# EAGLE design Unitbase_Keinz_2022 (EAGLE 9.4.2)

## Sheet 1 of 3
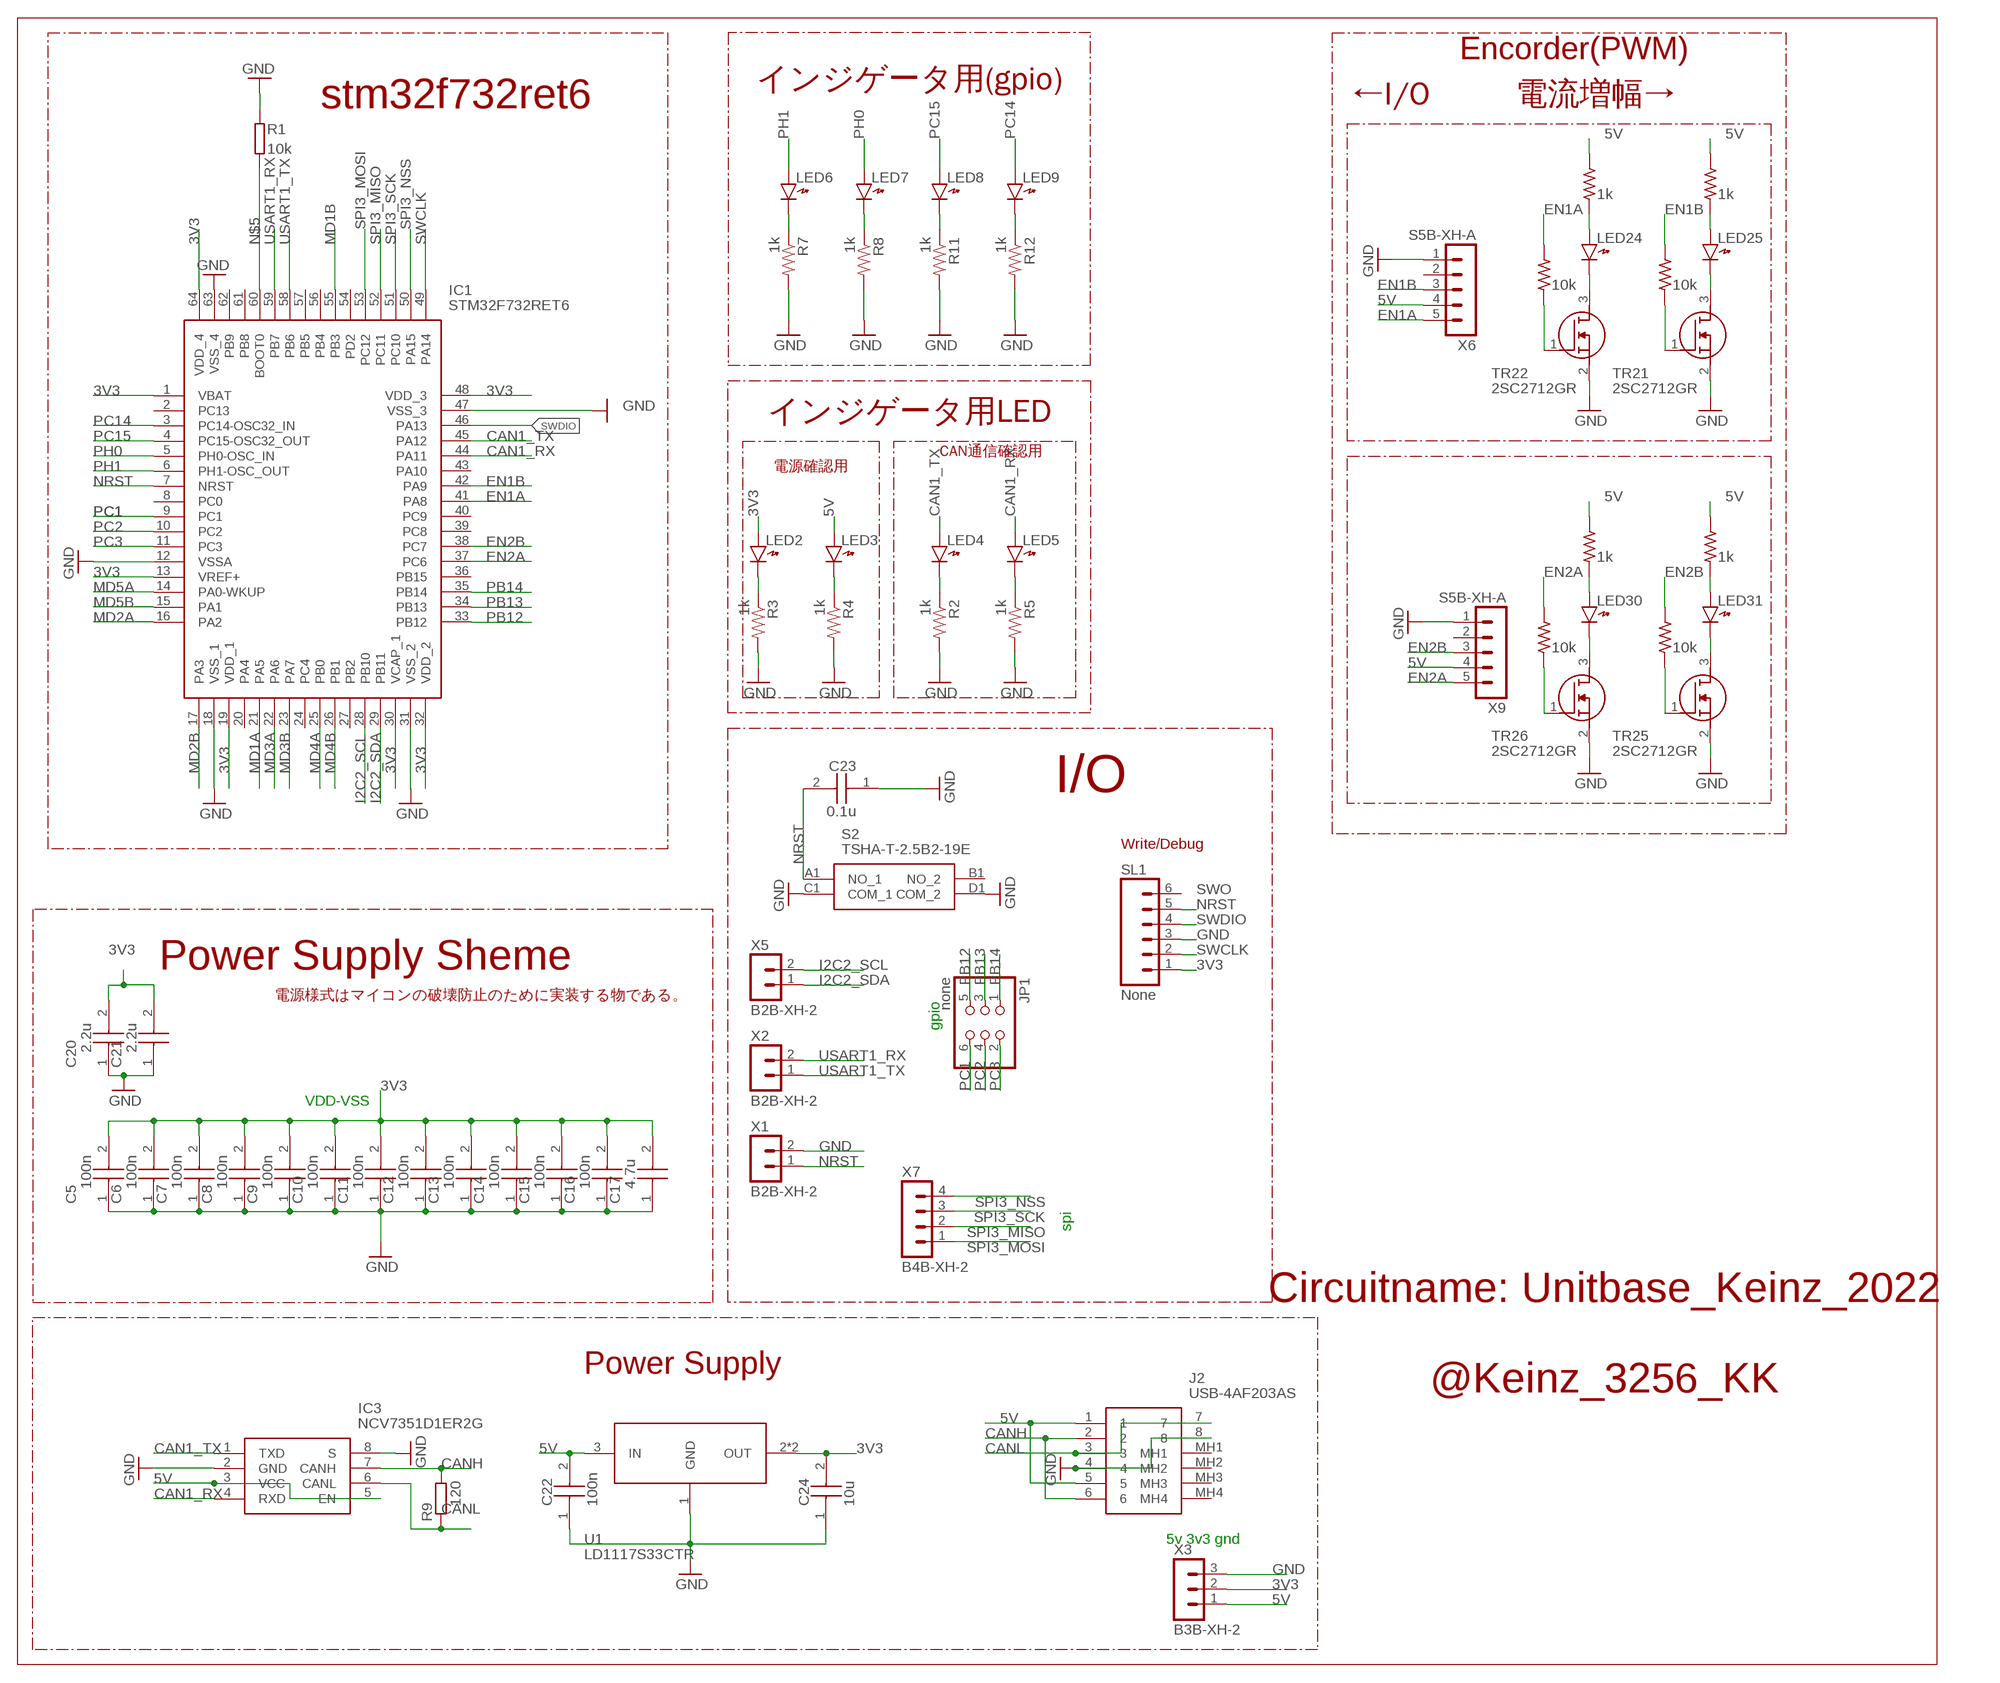
[diagram p0: schematic, sheet 1]

### Parts
C5  100n  AMK107BBJ476MA-RE  [CAPC1709X100N]
C6  100n  AMK107BBJ476MA-RE  [CAPC1709X100N]
C7  100n  AMK107BBJ476MA-RE  [CAPC1709X100N]
C8  100n  AMK107BBJ476MA-RE  [CAPC1709X100N]
C9  100n  AMK107BBJ476MA-RE  [CAPC1709X100N]
C10  100n  AMK107BBJ476MA-RE  [CAPC1709X100N]
C11  100n  AMK107BBJ476MA-RE  [CAPC1709X100N]
C12  100n  AMK107BBJ476MA-RE  [CAPC1709X100N]
C13  100n  AMK107BBJ476MA-RE  [CAPC1709X100N]
C14  100n  AMK107BBJ476MA-RE  [CAPC1709X100N]
C15  100n  AMK107BBJ476MA-RE  [CAPC1709X100N]
C16  100n  AMK107BBJ476MA-RE  [CAPC1709X100N]
C17  4.7u  AMK107BBJ476MA-RE  [CAPC1709X100N]
C20  2.2u  AMK107BBJ476MA-RE  [CAPC1709X100N]
C21  2.2u  AMK107BBJ476MA-RE  [CAPC1709X100N]
C22  100n  GRM188B31A106KE69D  [CAPC1608X90N]
C23  0.1u  AMK107BBJ476MA-RE  [CAPC1709X100N]
C24  10u  GRM188B31A106KE69D  [CAPC1608X90N]
IC1  STM32F732RET6  [QFP50P1200X1200X160-64N@1]
IC3  NCV7351D1ER2G  [SOIC127P600X175-8N]
J2  USB-4AF203AS  [USB4AF203AS]
JP1  none  PINHD-2X3  [2X03]
LED2  LED1608  [LED1608]
LED3  LED1608  [LED1608]
LED4  LED1608  [LED1608]
LED5  LED1608  [LED1608]
LED6  LED1608  [LED1608]
LED7  LED1608  [LED1608]
LED8  LED1608  [LED1608]
LED9  LED1608  [LED1608]
LED24  LED1608  [LED1608]
LED25  LED1608  [LED1608]
LED30  LED1608  [LED1608]
LED31  LED1608  [LED1608]
R1  10k  RESISTOR1608  [SMD1608]
R2  1k  R-US_R0603  [R0603]
R3  1k  R-US_R0603  [R0603]
R4  1k  R-US_R0603  [R0603]
R5  1k  R-US_R0603  [R0603]
R7  1k  R-US_R0603  [R0603]
R8  1k  R-US_R0603  [R0603]
R9  120  R1608  [1608]
R11  1k  R-US_R0603  [R0603]
R12  1k  R-US_R0603  [R0603]
R54  10k  RESISTOR-US1608  [SMD1608]
R59  1k  RESISTOR-US1608  [SMD1608]
R60  10k  RESISTOR-US1608  [SMD1608]
R61  1k  RESISTOR-US1608  [SMD1608]
R66  10k  RESISTOR-US1608  [SMD1608]
R67  1k  RESISTOR-US1608  [SMD1608]
R68  10k  RESISTOR-US1608  [SMD1608]
R69  1k  RESISTOR-US1608  [SMD1608]
S2  TSHA-T-2.5B2-19E  [TSHAT25B219E]
SL1  None  MA06  [06PA]
TR21  2SC2712GR  SOT-23_NMOS  [SOT-23]
TR22  2SC2712GR  SOT-23_NMOS  [SOT-23]
TR25  2SC2712GR  SOT-23_NMOS  [SOT-23]
TR26  2SC2712GR  SOT-23_NMOS  [SOT-23]
U1  LD1117S33CTR  [SOT223]
X1  B2B-XH-2  [B2B-XH-A]
X2  B2B-XH-2  [B2B-XH-A]
X3  B3B-XH-2  [B3B-XH-A]
X5  B2B-XH-2  [B2B-XH-A]
X6  S5B-XH-A  [S5B-XH-A]
X7  B4B-XH-2  [B4B-XH-A]
X9  S5B-XH-A  [S5B-XH-A]

### Nets
3V3: C5.2 C6.2 C7.2 C8.2 C9.2 C10.2 C11.2 C12.2 C13.2 C14.2 C15.2 C16.2 C17.2 C20.2 C21.2 C24.2 IC1.1(VBAT) IC1.13(VREF+) IC1.19(VDD_1) IC1.30(VCAP_1) IC1.32(VDD_2) IC1.48(VDD_3) IC1.64(VDD_4) LED2.A SL1.1 U1.2(OUT) U1.4(OUT) X3.2 ; also sheet 2,3
5V: C22.2 IC3.3(VCC) IC3.5(EN) J2.1 J2.5 LED3.A R59.1 R61.1 R67.1 R69.1 U1.3(IN) X3.1 X6.4 X9.4
CAN1_RX: IC1.44(PA11) IC3.4(RXD) LED5.A
CAN1_TX: IC1.45(PA12) IC3.1(TXD) LED4.A
CANH: IC3.7(CANH) J2.2 J2.6 R9.2
CANL: IC3.6(CANL) J2.3 J2.7 R9.1
EN1A: IC1.41(PA8) R54.1 X6.5
EN1B: IC1.42(PA9) R60.1 X6.3
EN2A: IC1.37(PC6) R66.1 X9.5
EN2B: IC1.38(PC7) R68.1 X9.3
GND: C5.1 C6.1 C7.1 C8.1 C9.1 C10.1 C11.1 C12.1 C13.1 C14.1 C15.1 C16.1 C17.1 C20.1 C21.1 C22.1 C23.1 C24.1 IC1.12(VSSA) IC1.18(VSS_1) IC1.31(VSS_2) IC1.47(VSS_3) IC1.63(VSS_4) IC3.2(GND) IC3.8(S) J2.4 J2.8 R1.1 R2.2 R3.2 R4.2 R5.2 R7.2 R8.2 R11.2 R12.2 S2.C1(COM_1) S2.D1(COM_2) SL1.3 TR21.2(S) TR22.2(S) TR25.2(S) TR26.2(S) U1.1(GND) X1.2 X3.3 X6.1 X9.1 ; also sheet 3
I2C2_SCL: IC1.28(PB10) X5.2
I2C2_SDA: IC1.29(PB11) X5.1
MD1A: IC1.21(PA5) ; also sheet 3
MD1B: IC1.55(PB3) ; also sheet 3
MD2A: IC1.16(PA2) ; also sheet 3
MD2B: IC1.17(PA3) ; also sheet 3
MD3A: IC1.22(PA6) ; also sheet 3
MD3B: IC1.23(PA7) ; also sheet 3
MD4A: IC1.25(PB0) ; also sheet 3
MD4B: IC1.26(PB1) ; also sheet 3
MD5A: IC1.14(PA0-WKUP) ; also sheet 3
MD5B: IC1.15(PA1) ; also sheet 3
N$1: LED7.K R8.1
N$5: IC1.60(BOOT0) R1.2
N$7: LED2.K R3.1
N$8: LED3.K R4.1
N$11: LED5.K R5.1
N$13: LED4.K R2.1
N$20: R54.2 TR22.1(G)
N$21: LED24.K TR22.3(D)
N$22: LED6.K R7.1
N$23: LED9.K R12.1
N$24: LED24.A R59.2
N$25: LED8.K R11.1
N$38: R60.2 TR21.1(G)
N$46: LED25.K TR21.3(D)
N$48: LED25.A R61.2
N$69: R66.2 TR26.1(G)
N$71: LED30.K TR26.3(D)
N$75: LED30.A R67.2
N$77: R68.2 TR25.1(G)
N$81: LED31.K TR25.3(D)
N$83: LED31.A R69.2
NRST: C23.2 IC1.7(NRST) S2.A1(NO_1) SL1.5 X1.1
PB12: IC1.33(PB12) JP1.5
PB13: IC1.34(PB13) JP1.3
PB14: IC1.35(PB14) JP1.1
PC1: IC1.9(PC1) JP1.6
PC2: IC1.10(PC2) JP1.4
PC3: IC1.11(PC3) JP1.2
PC14: IC1.3(PC14-OSC32_IN) LED9.A
PC15: IC1.4(PC15-OSC32_OUT) LED8.A
PH0: IC1.5(PH0-OSC_IN) LED7.A
PH1: IC1.6(PH1-OSC_OUT) LED6.A
SPI3_MISO: IC1.52(PC11) X7.2
SPI3_MOSI: IC1.53(PC12) X7.1
SPI3_NSS: IC1.50(PA15) X7.4
SPI3_SCK: IC1.51(PC10) X7.3
SWCLK: IC1.49(PA14) SL1.2
SWDIO: IC1.46(PA13) SL1.4
USART1_RX: IC1.59(PB7) X2.2
USART1_TX: IC1.58(PB6) X2.1
Unconnected: IC1.2(PC13) IC1.8(PC0) IC1.20(PA4) IC1.24(PC4) IC1.27(PB2) IC1.36(PB15) IC1.39(PC8) IC1.40(PC9) IC1.43(PA10) IC1.54(PD2) IC1.56(PB4) IC1.57(PB5) IC1.61(PB8) IC1.62(PB9) J2.MH1 J2.MH2 J2.MH3 J2.MH4 S2.B1(NO_2) SL1.6 X6.2 X9.2

### Notes on the sheet
- Encorder(PWM)
- インジゲータ用(gpio)
- stm32f732ret6 | ←I/O         電流増幅→
- インジゲータ用LED
- CAN通信確認用
- 電源確認用
- I/O
- Write/Debug
- SWO
- Power Supply Sheme
- 電源様式はマイコンの破壊防止のために実装する物である。
- gpio
- VDD-VSS
- spi
- Circuitname: Unitbase_Keinz_2022
  
  @Keinz_3256_KK
- Power Supply
- 5v 3v3 gnd

## Sheet 2 of 3: 12V
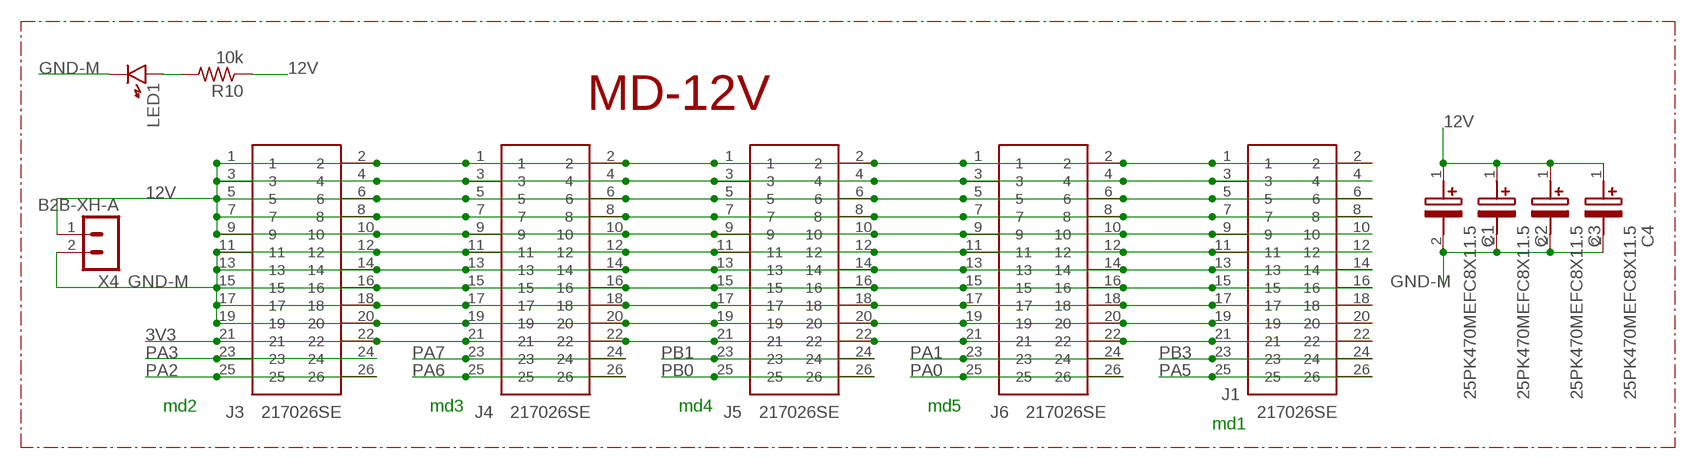
[diagram p1: schematic, sheet 2]

### Parts
C1  25PK470MEFC8X11.5  [CAPPRD350W60D825H1150]
C2  25PK470MEFC8X11.5  [CAPPRD350W60D825H1150]
C3  25PK470MEFC8X11.5  [CAPPRD350W60D825H1150]
C4  25PK470MEFC8X11.5  [CAPPRD350W60D825H1150]
J1  217026SE  [217026SE]
J3  217026SE  [217026SE]
J4  217026SE  [217026SE]
J5  217026SE  [217026SE]
J6  217026SE  [217026SE]
LED1  LED1608  [LED1608]
R10  10k  R-US_R0603  [R0603]
X4  B2B-XH-A  [B2B-XH-A]

### Nets
3V3: J1.21 J1.22 J3.21 J3.22 J4.21 J4.22 J5.21 J5.22 J6.21 J6.22 ; also sheet 1,3
12V: C1.1(+) C2.1(+) C3.1(+) C4.1(+) J1.1 J1.2 J1.3 J1.4 J1.5 J1.6 J1.7 J1.8 J1.9 J1.10 J3.1 J3.2 J3.3 J3.4 J3.5 J3.6 J3.7 J3.8 J3.9 J3.10 J4.1 J4.2 J4.3 J4.4 J4.5 J4.6 J4.7 J4.8 J4.9 J4.10 J5.1 J5.2 J5.3 J5.4 J5.5 J5.6 J5.7 J5.8 J5.9 J5.10 J6.1 J6.2 J6.3 J6.4 J6.5 J6.6 J6.7 J6.8 J6.9 J6.10 R10.1 X4.1
GND-M: C1.2(-) C2.2(-) C3.2(-) C4.2(-) J1.11 J1.12 J1.13 J1.14 J1.15 J1.16 J1.17 J1.18 J1.19 J1.20 J3.11 J3.12 J3.13 J3.14 J3.15 J3.16 J3.17 J3.18 J3.19 J3.20 J4.11 J4.12 J4.13 J4.14 J4.15 J4.16 J4.17 J4.18 J4.19 J4.20 J5.11 J5.12 J5.13 J5.14 J5.15 J5.16 J5.17 J5.18 J5.19 J5.20 J6.11 J6.12 J6.13 J6.14 J6.15 J6.16 J6.17 J6.18 J6.19 J6.20 LED1.K X4.2
N$12: LED1.A R10.2
PA0: J6.25 J6.26 ; also sheet 3
PA1: J6.23 J6.24 ; also sheet 3
PA2: J3.25 J3.26 ; also sheet 3
PA3: J3.23 J3.24 ; also sheet 3
PA5: J1.25 J1.26 ; also sheet 3
PA6: J4.25 J4.26 ; also sheet 3
PA7: J4.23 J4.24 ; also sheet 3
PB0: J5.25 J5.26 ; also sheet 3
PB1: J5.23 J5.24 ; also sheet 3
PB3: J1.23 J1.24 ; also sheet 3

### Notes on the sheet
- MD-12V
- md2 | md3 | md4 | md5
- md1

## Sheet 3 of 3: 電流増幅
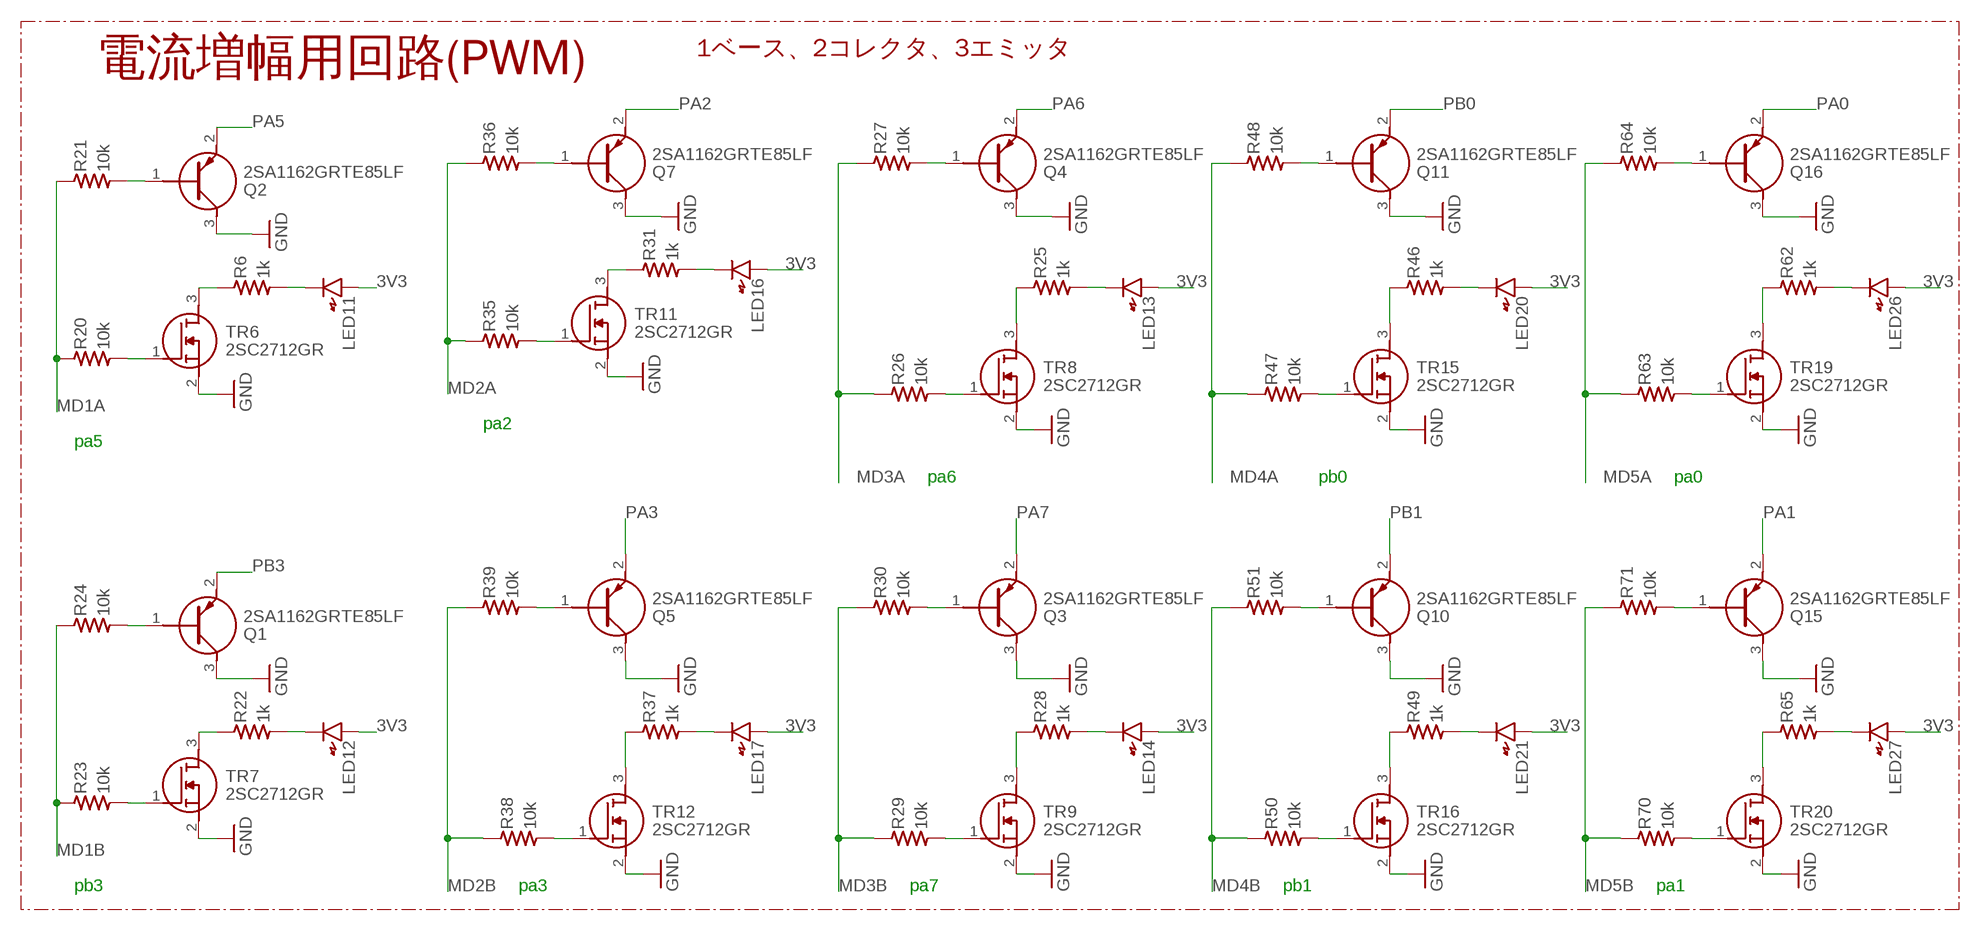
[diagram p2: schematic, sheet 3]

### Parts
LED11  LED1608  [LED1608]
LED12  LED1608  [LED1608]
LED13  LED1608  [LED1608]
LED14  LED1608  [LED1608]
LED16  LED1608  [LED1608]
LED17  LED1608  [LED1608]
LED20  LED1608  [LED1608]
LED21  LED1608  [LED1608]
LED26  LED1608  [LED1608]
LED27  LED1608  [LED1608]
Q1  2SA1162GRTE85LF  [2SA1162GRTE85LF]
Q2  2SA1162GRTE85LF  [2SA1162GRTE85LF]
Q3  2SA1162GRTE85LF  [2SA1162GRTE85LF]
Q4  2SA1162GRTE85LF  [2SA1162GRTE85LF]
Q5  2SA1162GRTE85LF  [2SA1162GRTE85LF]
Q7  2SA1162GRTE85LF  [2SA1162GRTE85LF]
Q10  2SA1162GRTE85LF  [2SA1162GRTE85LF]
Q11  2SA1162GRTE85LF  [2SA1162GRTE85LF]
Q15  2SA1162GRTE85LF  [2SA1162GRTE85LF]
Q16  2SA1162GRTE85LF  [2SA1162GRTE85LF]
R6  1k  RESISTOR-US1608  [SMD1608]
R20  10k  RESISTOR-US1608  [SMD1608]
R21  10k  RESISTOR-US1608  [SMD1608]
R22  1k  RESISTOR-US1608  [SMD1608]
R23  10k  RESISTOR-US1608  [SMD1608]
R24  10k  RESISTOR-US1608  [SMD1608]
R25  1k  RESISTOR-US1608  [SMD1608]
R26  10k  RESISTOR-US1608  [SMD1608]
R27  10k  RESISTOR-US1608  [SMD1608]
R28  1k  RESISTOR-US1608  [SMD1608]
R29  10k  RESISTOR-US1608  [SMD1608]
R30  10k  RESISTOR-US1608  [SMD1608]
R31  1k  RESISTOR-US1608  [SMD1608]
R35  10k  RESISTOR-US1608  [SMD1608]
R36  10k  RESISTOR-US1608  [SMD1608]
R37  1k  RESISTOR-US1608  [SMD1608]
R38  10k  RESISTOR-US1608  [SMD1608]
R39  10k  RESISTOR-US1608  [SMD1608]
R46  1k  RESISTOR-US1608  [SMD1608]
R47  10k  RESISTOR-US1608  [SMD1608]
R48  10k  RESISTOR-US1608  [SMD1608]
R49  1k  RESISTOR-US1608  [SMD1608]
R50  10k  RESISTOR-US1608  [SMD1608]
R51  10k  RESISTOR-US1608  [SMD1608]
R62  1k  RESISTOR-US1608  [SMD1608]
R63  10k  RESISTOR-US1608  [SMD1608]
R64  10k  RESISTOR-US1608  [SMD1608]
R65  1k  RESISTOR-US1608  [SMD1608]
R70  10k  RESISTOR-US1608  [SMD1608]
R71  10k  RESISTOR-US1608  [SMD1608]
TR6  2SC2712GR  SOT-23_NMOS  [SOT-23]
TR7  2SC2712GR  SOT-23_NMOS  [SOT-23]
TR8  2SC2712GR  SOT-23_NMOS  [SOT-23]
TR9  2SC2712GR  SOT-23_NMOS  [SOT-23]
TR11  2SC2712GR  SOT-23_NMOS  [SOT-23]
TR12  2SC2712GR  SOT-23_NMOS  [SOT-23]
TR15  2SC2712GR  SOT-23_NMOS  [SOT-23]
TR16  2SC2712GR  SOT-23_NMOS  [SOT-23]
TR19  2SC2712GR  SOT-23_NMOS  [SOT-23]
TR20  2SC2712GR  SOT-23_NMOS  [SOT-23]

### Nets
3V3: LED11.A LED12.A LED13.A LED14.A LED16.A LED17.A LED20.A LED21.A LED26.A LED27.A ; also sheet 1,2
GND: Q1.3(C) Q2.3(C) Q3.3(C) Q4.3(C) Q5.3(C) Q7.3(C) Q10.3(C) Q11.3(C) Q15.3(C) Q16.3(C) TR6.2(S) TR7.2(S) TR8.2(S) TR9.2(S) TR11.2(S) TR12.2(S) TR15.2(S) TR16.2(S) TR19.2(S) TR20.2(S) ; also sheet 1
MD1A: R20.1 R21.1 ; also sheet 1
MD1B: R23.1 R24.1 ; also sheet 1
MD2A: R35.1 R36.1 ; also sheet 1
MD2B: R38.1 R39.1 ; also sheet 1
MD3A: R26.1 R27.1 ; also sheet 1
MD3B: R29.1 R30.1 ; also sheet 1
MD4A: R47.1 R48.1 ; also sheet 1
MD4B: R50.1 R51.1 ; also sheet 1
MD5A: R63.1 R64.1 ; also sheet 1
MD5B: R70.1 R71.1 ; also sheet 1
N$2: R6.1 TR6.3(D)
N$3: R20.2 TR6.1(G)
N$4: LED11.K R6.2
N$6: R22.1 TR7.3(D)
N$9: R23.2 TR7.1(G)
N$10: LED12.K R22.2
N$14: Q1.1(B) R24.2
N$15: Q2.1(B) R21.2
N$16: R25.1 TR8.3(D)
N$17: R26.2 TR8.1(G)
N$18: LED13.K R25.2
N$19: R28.1 TR9.3(D)
N$29: R29.2 TR9.1(G)
N$32: LED14.K R28.2
N$34: Q3.1(B) R30.2
N$35: Q4.1(B) R27.2
N$36: R31.1 TR11.3(D)
N$37: R35.2 TR11.1(G)
N$47: LED16.K R31.2
N$49: R37.1 TR12.3(D)
N$50: R38.2 TR12.1(G)
N$51: LED17.K R37.2
N$52: Q5.1(B) R39.2
N$53: Q7.1(B) R36.2
N$62: R46.1 TR15.3(D)
N$63: R47.2 TR15.1(G)
N$64: LED20.K R46.2
N$65: R49.1 TR16.3(D)
N$66: R50.2 TR16.1(G)
N$67: LED21.K R49.2
N$68: Q10.1(B) R51.2
N$70: Q11.1(B) R48.2
N$88: R62.1 TR19.3(D)
N$89: R63.2 TR19.1(G)
N$90: LED26.K R62.2
N$91: R65.1 TR20.3(D)
N$92: R70.2 TR20.1(G)
N$93: LED27.K R65.2
N$94: Q15.1(B) R71.2
N$95: Q16.1(B) R64.2
PA0: Q16.2(E) ; also sheet 2
PA1: Q15.2(E) ; also sheet 2
PA2: Q7.2(E) ; also sheet 2
PA3: Q5.2(E) ; also sheet 2
PA5: Q2.2(E) ; also sheet 2
PA6: Q4.2(E) ; also sheet 2
PA7: Q3.2(E) ; also sheet 2
PB0: Q11.2(E) ; also sheet 2
PB1: Q10.2(E) ; also sheet 2
PB3: Q1.2(E) ; also sheet 2

### Notes on the sheet
- 電流増幅用回路(PWM) | 1ベース、2コレクタ、3エミッタ
- pa2
- pa5
- pa6 | pb0 | pa0
- pb3 | pa3 | pa7 | pb1 | pa1

## Library data of the parts
C1-C4 = SamacSys_Parts:25PK470MEFC8X11.5: Rubycon 470uF 25 V dc Aluminium Electrolytic Capacitor, PK Series 2000h 8 Dia. x 11.5mm Source: Datasheet <http://www.rubycon.co.jp/en/catalog/e_pdfs/aluminum/e_pk.pdf>; DESCRIPTION: Rubycon 470uF 25 V dc Aluminium Electrolytic Capacitor, PK Series 2000h 8 Dia. x 11.5mm; HEIGHT: 11.5mm; MANUFACTURER_NAME: Rubycon; MANUFACTURER_PART_NUMBER: 25PK470MEFC8X11.5; MOUSER_PART_NUMBER: 232-25PK470MEFC8X115; MOUSER_PRICE-STOCK: https://www.mouser.co.uk/ProductDetail/Rubycon/25PK470MEFC8X115?qs=T3oQrply3y%252BFwMonqVFqXg%3D%3D
C5-C17 C20 C21 C23 = SamacSys_Parts:AMK107BBJ476MA-RE: 0603 (1608M) 47uF MLCC 4V dc +/-20% SMD Source: Datasheet <https://ds.yuden.co.jp/TYCOMPAS/ut/detail?pn=AMK107BBJ476MA-RE&u=M>; DESCRIPTION: 0603 (1608M) 47uF MLCC 4V dc +/-20% SMD; HEIGHT: 1mm; MANUFACTURER_NAME: TAIYO YUDEN; MANUFACTURER_PART_NUMBER: AMK107BBJ476MA-RE; MOUSER_PART_NUMBER: 963-AMK107BBJ476MARE; MOUSER_PRICE-STOCK: https://www.mouser.com/Search/Refine.aspx?Keyword=963-AMK107BBJ476MARE; RS_PART_NUMBER: 1843762P; RS_PRICE-STOCK: http://uk.rs-online.com/web/p/products/1843762P
C22 C24 = SamacSys_Parts:GRM188B31A106KE69D: Murata 1608 GRM 10000nF Ceramic Multilayer Capacitor, 10 V dc, +85C, B Dielectric, +/-10% Source: Datasheet <http://www.murata.com/~/media/webrenewal/support/library/catalog/products/capacitor/mlcc/c02e.pdf>; DESCRIPTION: Murata 1608 GRM 10000nF Ceramic Multilayer Capacitor, 10 V dc, +85C, B Dielectric, +/-10%; HEIGHT: 0.9mm; MANUFACTURER_NAME: Murata Electronics; MANUFACTURER_PART_NUMBER: GRM188B31A106KE69D; RS_PART_NUMBER: 8847157P; RS_PRICE-STOCK: http://uk.rs-online.com/web/p/products/8847157P
IC1 = SamacSys_Parts:STM32F732RET6: STMICROELECTRONICS - STM32F732RET6 - MCU, ARM CORTEX-M7, 216MHZ, LQFP-64 Source: Datasheet <https://www.st.com/resource/en/datasheet/stm32f732re.pdf>; ARROW_PART_NUMBER: STM32F732RET6; ARROW_PRICE-STOCK: https://www.arrow.com/en/products/stm32f732ret6/stmicroelectronics?region=nac; DESCRIPTION: STMICROELECTRONICS - STM32F732RET6 - MCU, ARM CORTEX-M7, 216MHZ, LQFP-64; HEIGHT: 1.6mm; MANUFACTURER_NAME: STMicroelectronics; MANUFACTURER_PART_NUMBER: STM32F732RET6; MOUSER_PART_NUMBER: 511-STM32F732RET6; MOUSER_PRICE-STOCK: https://www.mouser.co.uk/ProductDetail/STMicroelectronics/STM32F732RET6?qs=ObEXV34I18OJOCW3Zu7wxw%3D%3D
IC3 = SamacSys_Parts:NCV7351D1ER2G: ON Semiconductor NCV7351D1ER2G, CAN Transceiver 1Mbit/s 1-channel ISO 11898-2, 8-Pin SOIC Source: Datasheet <http://www.onsemi.com/pub/Collateral/NCV7351-D.PDF>; ARROW_PART_NUMBER: NCV7351D1ER2G; ARROW_PRICE-STOCK: https://www.arrow.com/en/products/ncv7351d1er2g/on-semiconductor; DESCRIPTION: ON Semiconductor NCV7351D1ER2G, CAN Transceiver 1Mbit/s 1-channel ISO 11898-2, 8-Pin SOIC; HEIGHT: 1.75mm; MANUFACTURER_NAME: ON Semiconductor; MANUFACTURER_PART_NUMBER: NCV7351D1ER2G; MOUSER_PART_NUMBER: 863-NCV7351D1ER2G; MOUSER_PRICE-STOCK: https://www.mouser.co.uk/ProductDetail/ON-Semiconductor/NCV7351D1ER2G?qs=l5F7KFZg3O5tNFBk2wxDRg%3D%3D
J1 J3-J6 = maya_common:217026SE
J2 = SamacSys_Parts:USB-4AF203AS: USB Connector, A type Female, Dual Port 4P x 2 Stacked, Right Angle type. Source: Datasheet <http://akizukidenshi.com/download/ds/useconn/USB-4AF203AS-CT.PDF>; DESCRIPTION: USB Connector, A type Female, Dual Port 4P x 2 Stacked, Right Angle type.; HEIGHT: 15.5mm; MANUFACTURER_NAME: Useconn Electronics; MANUFACTURER_PART_NUMBER: USB-4AF203AS
JP1 = pinhead:PINHD-2X3: PIN HEADER
LED1-LED9 LED11-LED14 LED16 LED17 LED20 LED21 LED24-LED27 LED30 LED31 = generic:LED: Generic LEDs
Q1-Q5 Q7 Q10 Q11 Q15 Q16 = SamacSys_Parts:2SA1162GRTE85LF: TOSHIBA Transistor Silicon PNP Epitaxial Type (PCT process) Source: Datasheet <https://www.arrow.com/en/products/2sa1162-gr-te85lf/toshiba>; ARROW_PART_NUMBER: 2SA1162GRTE85LF; ARROW_PRICE-STOCK: https://www.arrow.com/en/products/2sa1162-gr-te85lf/toshiba; DESCRIPTION: TOSHIBA Transistor Silicon PNP Epitaxial Type (PCT process); HEIGHT: 1.56mm; MANUFACTURER_NAME: Toshiba; MANUFACTURER_PART_NUMBER: 2SA1162GRTE85LF
R1 = generic:RESISTOR: Generic Registor
R2-R5 R7 R8 R10-R12 = audio amplifier example:R-US_: RESISTOR, American symbol
R6 R20-R31 R35-R39 R46-R51 R54 R59-R71 = generic:RESISTOR-US: Generic Registor
R9 = 1608:R1608
S2 = SamacSys_Parts:TSHA-T-2.5B2-19E: Switch Source: Datasheet <http://akizukidenshi.com/download/ds/topup/TSHA-T-2.5B2-19E.pdf>; DESCRIPTION: Switch; HEIGHT: 2.5mm; MANUFACTURER_NAME: Akizuki Denshi Tsusho; MANUFACTURER_PART_NUMBER: TSHA-T-2.5B2-19E
SL1 = con-amp-quick:MA06: AMP QUICK CONNECTOR; OC_FARNELL: unknown; OC_NEWARK: unknown
TR6-TR9 TR11 TR12 TR15 TR16 TR19-TR22 TR25 TR26 = maya_smd:SOT-23_NMOS
U1 = LD1117S33CTR:LD1117S33CTR: http://octopart.com/ld1117s33tr-stmicroelectronics-526708; AVAILABILITY: Unavailable; DESCRIPTION: LD1117 Series 1300 mA 3.3 V Fixed Output Positive Voltage LDO Regulator- SOT-223; MF: STMicroelectronics; MP: LD1117S33CTR; PACKAGE: SOT-223 STMicroelectronics; PRICE: None
X1 X2 X4 X5 = con-JST_XH:B2B-XH: JST XH series header 2.50mm pitch disconnectable crimp style connectors, vertical (side entry type), 2 pins
X3 = con-JST_XH:B3B-XH: JST XH series header 2.50mm pitch disconnectable crimp style connectors, vertical (side entry type), 3 pins
X6 X9 = con-JST XH:S5B-XH: JST XH series header 2.50mm pitch disconnectable crimp style connectors, horizontal (side entry type), 5 pins
X7 = con-JST_XH:B4B-XH: JST XH series header 2.50mm pitch disconnectable crimp style connectors, vertical (side entry type), 4 pins

## Board
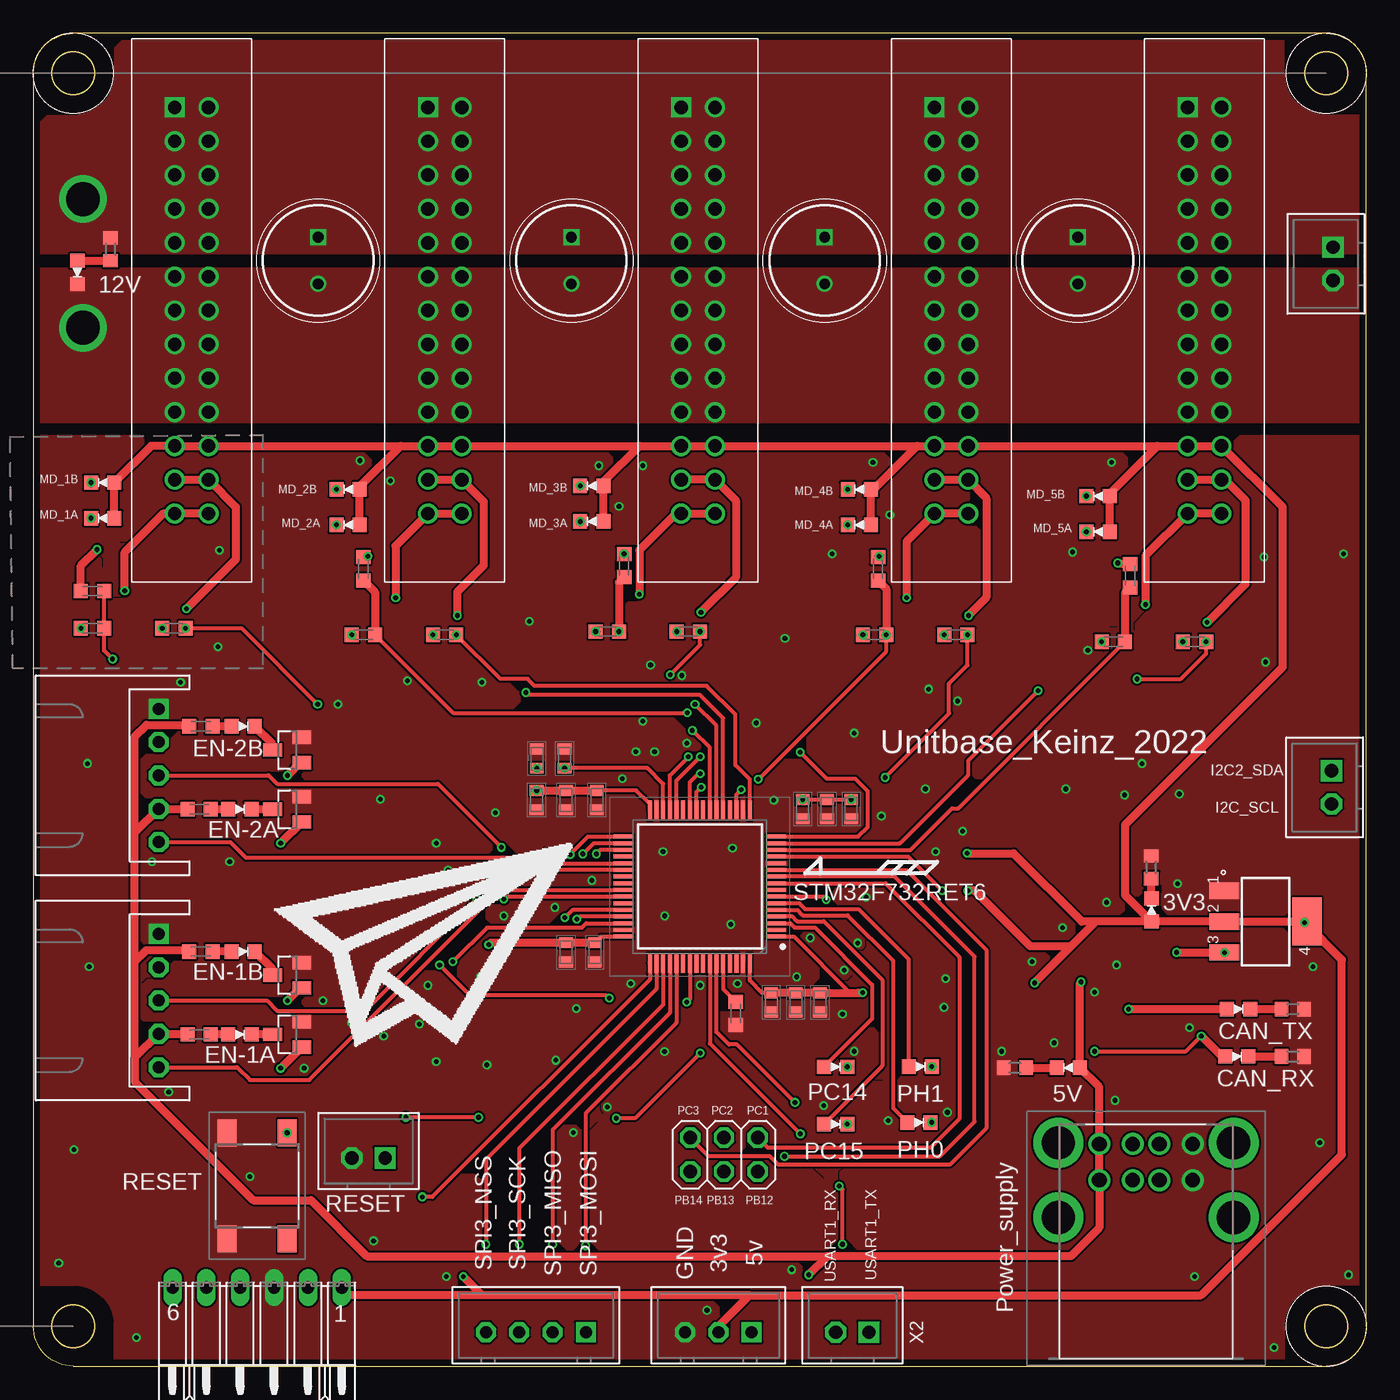
[diagram p3: board, top side]
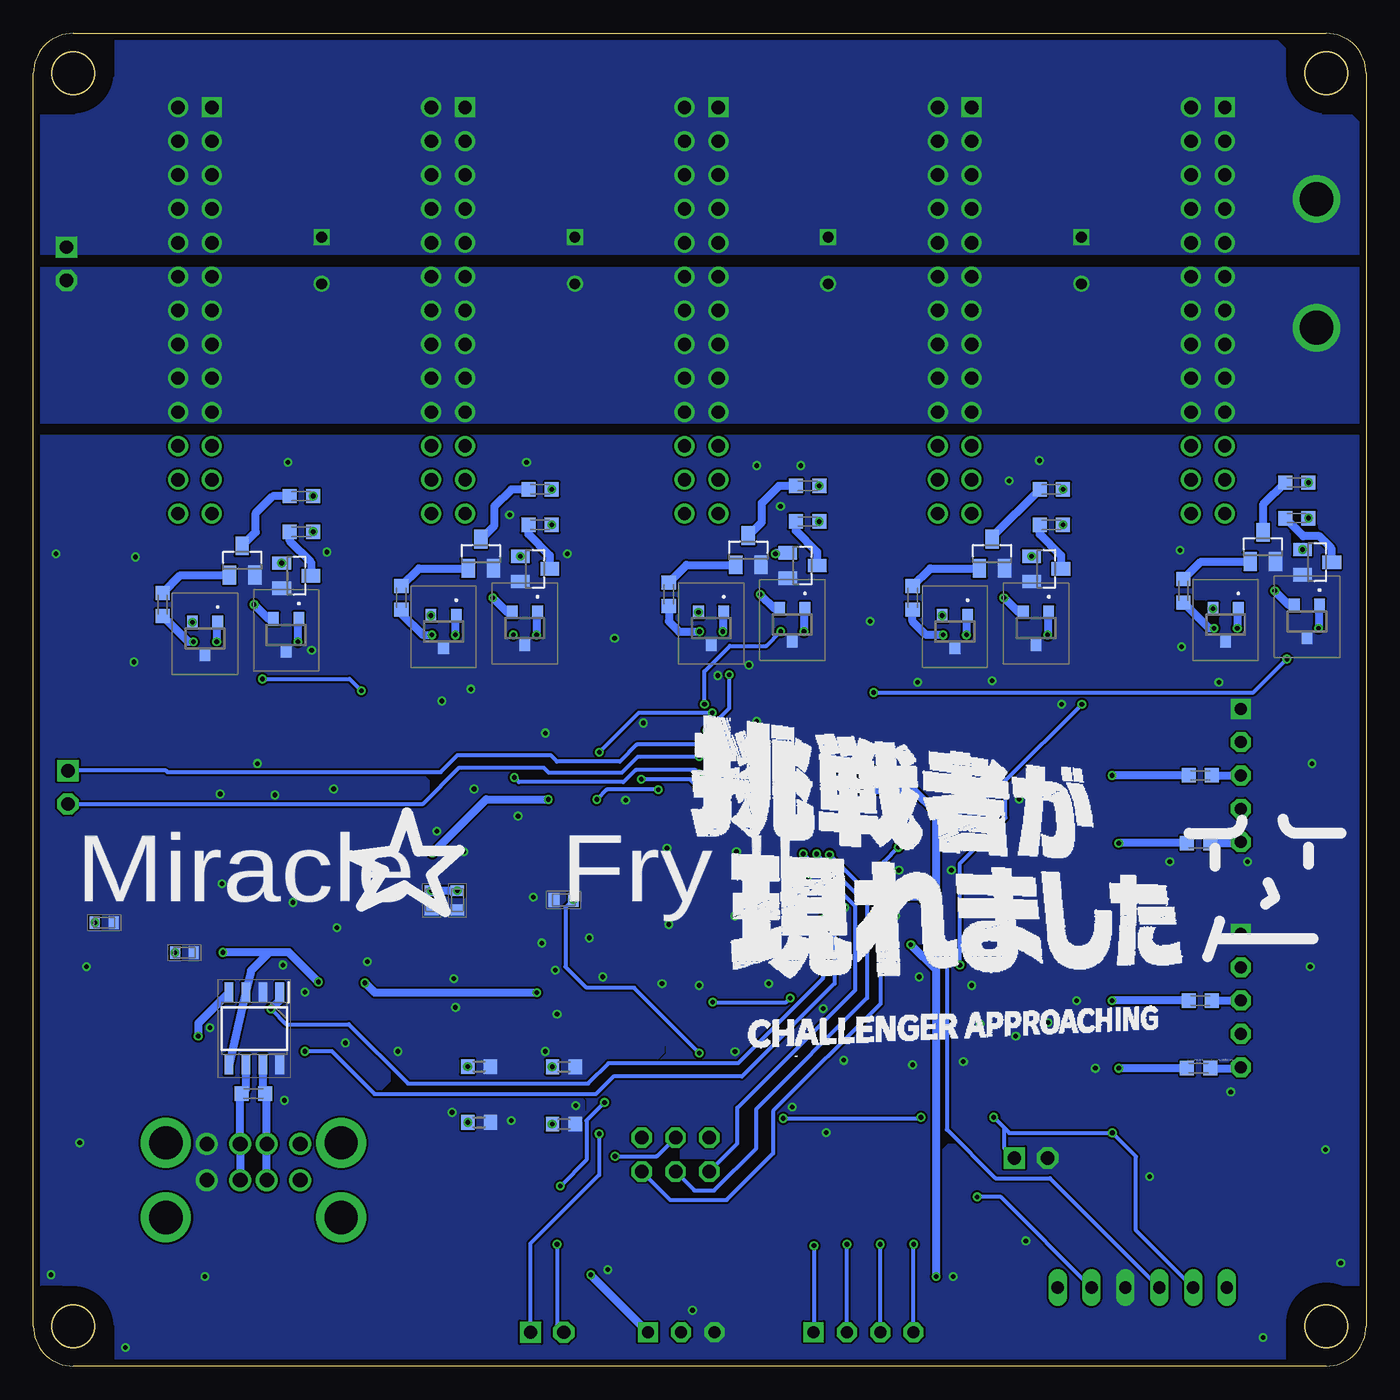
[diagram p4: board, bottom side, seen from below]

Size 100 x 100 mm. Coordinates in mm from the lower left corner, seen from the top.
Outline: 3,0 97,0 arc90 100,3 100,97 arc90 97,100 3,100 arc90 0,97 0,3 arc90 3,0
Outline: circle at 3,97 radius 1.6
Outline: circle at 97,3 radius 1.6
Outline: circle at 97,97 radius 1.6
Outline: circle at 3,3 radius 1.6
Copper layers (1*16): Top 0.035mm / dielectric 1.6mm / Bottom 0.035mm
Design rules "Elecrow_2-layer_PCB_eagle_rule": minimum track width 6mil, minimum drill 12mil, track to track 6mil, track to pad 6mil, pad to pad 6mil, via to via 8mil, smd to smd 0mil, copper to edge 20mil, drill to drill 10mil, minimum pad ring 6mil, minimum via ring 6mil, stop-mask expansion 0mil, vias tented up to drill 100mil, thermal gap 10mil
tRestrict: area 0,94 to 6,100; area 94,94 to 100,100; area 94,0 to 100,6; area 0,0 to 6,6; 179 lines
bRestrict: area 0,0.3 to 6,6.3; area 94,0 to 100,6; area 94,94 to 100,100; area 0,94 to 6,100; 53 lines

### Footprints (pad centres in the part's own frame; a part is rotated, then mirrored left to right if it is on the bottom)
CAPPRD350W60D825H1150 = drill 0.8 pad 1.2 square: 1 0,0 | drill 0.8 pad 1.2: 2 3.5,0
CAPC1709X100N = smd 0.81 x 1.04: 1 -0.72,0; 2 0.72,0
CAPC1608X90N = smd 0.75 x 0.94: 1 -0.7,0; 2 0.7,0
QFP50P1200X1200X160-64N@1 = smd 1.475 x 0.3: 1 -5.738,3.75; 2 -5.738,3.25; 3 -5.738,2.75; 4 -5.738,2.25; 5 -5.738,1.75; 6 -5.738,1.25; 7 -5.738,0.75; 8 -5.738,0.25; 9 -5.738,-0.25; 10 -5.738,-0.75; 11 -5.738,-1.25; 12 -5.738,-1.75; 13 -5.738,-2.25; 14 -5.738,-2.75; 15 -5.738,-3.25; 16 -5.738,-3.75; 33 5.738,-3.75; 34 5.738,-3.25; 35 5.738,-2.75; 36 5.738,-2.25; 37 5.738,-1.75; 38 5.738,-1.25; 39 5.738,-0.75; 40 5.738,-0.25; 41 5.738,0.25; 42 5.738,0.75; 43 5.738,1.25; 44 5.738,1.75; 45 5.738,2.25; 46 5.738,2.75; 47 5.738,3.25; 48 5.738,3.75 | smd 0.3 x 1.475: 17 -3.75,-5.738; 18 -3.25,-5.738; 19 -2.75,-5.738; 20 -2.25,-5.738; 21 -1.75,-5.738; 22 -1.25,-5.738; 23 -0.75,-5.738; 24 -0.25,-5.738; 25 0.25,-5.738; 26 0.75,-5.738; 27 1.25,-5.738; 28 1.75,-5.738; 29 2.25,-5.738; 30 2.75,-5.738; 31 3.25,-5.738; 32 3.75,-5.738; 49 3.75,5.738; 50 3.25,5.738; 51 2.75,5.738; 52 2.25,5.738; 53 1.75,5.738; 54 1.25,5.738; 55 0.75,5.738; 56 0.25,5.738; 57 -0.25,5.738; 58 -0.75,5.738; 59 -1.25,5.738; 60 -1.75,5.738; 61 -2.25,5.738; 62 -2.75,5.738; 63 -3.25,5.738; 64 -3.75,5.738
SOIC127P600X175-8N = smd 1.5 x 0.65: 1 -2.7,1.905; 2 -2.7,0.635; 3 -2.7,-0.635; 4 -2.7,-1.905; 5 2.7,-1.905; 6 2.7,-0.635; 7 2.7,0.635; 8 2.7,1.905
217026SE = drill 1 square: 1 -1.27,15.24 | drill 1: 2 1.27,15.24; 3 -1.27,12.7; 4 1.27,12.7; 5 -1.27,10.16; 6 1.27,10.16; 7 -1.27,7.62; 8 1.27,7.62; 9 -1.27,5.08; 10 1.27,5.08; 11 -1.27,2.54; 12 1.27,2.54; 13 -1.27,0; 14 1.27,0; 15 -1.27,-2.54; 16 1.27,-2.54; 17 -1.27,-5.08; 18 1.27,-5.08; 19 -1.27,-7.62; 20 1.27,-7.62; 21 -1.27,-10.16; 22 1.27,-10.16; 23 -1.27,-12.7; 24 1.27,-12.7; 25 -1.27,-15.24; 26 1.27,-15.24
USB4AF203AS = drill 1.1 pad 1.65: 1 0,0; 2 2.5,0; 3 4.5,0; 4 7,0; 5 0,-2.71; 6 2.5,-2.71; 7 4.5,-2.71; 8 7,-2.71 | drill 2.5 pad 3.75: MH1 -3.07,0.09; MH2 10.07,0.09; MH3 -3.07,-5.51; MH4 10.07,-5.51
2X03 = drill 1.016 octagon: 1 -2.54,-1.27; 2 -2.54,1.27; 3 0,-1.27; 4 0,1.27; 5 2.54,-1.27; 6 2.54,1.27
LED1608 = smd 1.05 x 1.08: A -0.875,0; K 0.875,0
2SA1162GRTE85LF = smd 0.8 x 1: 1 -0.95,-1.2; 2 0.95,-1.2; 3 0,1.2
SMD1608 = smd 1.05 x 1.08: 1 -0.875,0; 2 0.875,0
R0603 = smd 1 x 1.1: 1 -0.85,0; 2 0.85,0
1608 = smd 1.05 x 1.08: 1 -0.875,0; 2 0.875,0
TSHAT25B219E = smd 2.05 x 1.4: A1 -3.975,2.25; B1 3.975,2.25; C1 -3.975,-2.25; D1 3.975,-2.25
06PA = drill 0.914 long: 1 -6.35,0; 2 -3.81,0; 3 -1.27,0; 4 1.27,0; 5 3.81,0; 6 6.35,0
SOT-23 = smd 1 x 1.4: 1 -0.95,-1.1; 2 0.95,-1.1; 3 0,1.1
SOT223 = smd 2.235 x 1.219: 1 -3.099,2.311; 2 -3.099,0; 3 -3.099,-2.311 | smd 2.2 x 3.6: 4 3.099,0
B2B-XH-A = drill 1 pad 1.6 square: 1 1.25,0 | drill 1 pad 1.6 octagon: 2 -1.25,0
B3B-XH-A = drill 0.9 pad 1.5 square: 1 2.5,0 | drill 0.9 pad 1.5 octagon: 2 0,0; 3 -2.5,0
S5B-XH-A = drill 0.9 pad 1.5 square: 1 5,0 | drill 0.9 pad 1.5 octagon: 2 2.5,0; 3 0,0; 4 -2.5,0; 5 -5,0
B4B-XH-A = drill 0.9 pad 1.5 square: 1 3.75,0 | drill 0.9 pad 1.5 octagon: 2 1.25,0; 3 -1.25,0; 4 -3.75,0

### Placement (x,y rotation side)
C1  78.37,84.71 270 top
C2  21.37,84.71 270 top
C3  40.37,84.71 270 top
C4  59.37,84.71 270 top
C5  70.12,34.96 90 bottom
C6  39.98,31.06 90 top
C7  42.13,31.06 90 top
C8  57.72,41.8 90 top
C9  59.55,41.8 90 top
C10  61.36,41.8 90 top
C11  55.37,27.3 90 top
C12  57.2,27.3 90 top
C13  59.02,27.3 90 top
C14  68.19,34.96 90 bottom
C15  37.76,42.48 90 top
C16  39.96,42.48 90 top
C17  42.28,42.48 90 top
C20  39.86,45.58 270 top
C21  37.78,45.58 270 top
C22  88.67,31.03 180 bottom
C23  60.2,34.99 0 bottom
C24  94.68,33.29 180 bottom
IC1  50,35.98 180 top
IC3  83.42,25.33 270 bottom
J1  11.87,79.21 0 top
J2  79.98,16.67 0 top
J3  30.87,79.21 0 top
J4  49.87,79.21 0 top
J5  68.87,79.21 0 top
J6  87.87,79.21 0 top
JP1  51.82,15.88 0 top
LED1  3.3,82.06 270 top
LED2  83.89,34.23 90 top
LED3  77.65,22.39 180 top
LED4  90.42,26.8 0 top
LED5  90.3,23.24 0 top
LED6  66.56,22.48 0 top
LED7  66.45,18.29 0 top
LED8  60.2,18.16 0 top
LED9  60.2,22.46 0 top
LED11  5.21,63.63 180 top
LED12  5.21,66.29 180 top
LED13  41.91,63.37 180 top
LED14  41.91,66.04 180 top
LED16  23.62,63.12 180 top
LED17  23.62,65.79 180 top
LED20  61.98,63.12 180 top
LED21  61.98,65.79 180 top
LED24  15.49,24.89 0 top
LED25  15.75,31.11 0 top
LED26  79.88,62.61 180 top
LED27  79.88,65.28 180 top
LED30  15.49,41.78 0 top
LED31  15.75,48.01 0 top
Q1  10.54,55.63 180 bottom
Q2  4.45,55.88 180 bottom
Q3  49.15,55.37 180 bottom
Q4  43.05,55.63 180 bottom
Q5  30.86,55.12 180 bottom
Q7  24.77,55.37 180 bottom
Q10  69.22,55.12 180 bottom
Q11  63.12,55.37 180 bottom
Q15  87.12,54.61 180 bottom
Q16  81.03,54.86 180 bottom
R1  52.7,26.47 90 top
R2  94.49,26.8 0 top
R3  83.86,37.43 90 top
R4  73.64,22.39 180 top
R5  94.49,23.24 0 top
R6  5.21,63.63 0 bottom
R7  66.56,22.48 0 bottom
R8  66.55,18.29 0 bottom
R9  83.5,20.44 0 bottom
R10  5.8,83.8 270 top
R11  60.2,18.16 0 bottom
R12  60.2,22.46 0 bottom
R20  4.44,58.16 180 top
R21  4.44,55.37 180 top
R22  5.21,66.29 0 bottom
R23  13.72,58.17 90 bottom
R24  10.54,55.37 180 top
R25  41.91,63.37 0 bottom
R26  44.32,60.07 90 top
R27  43.05,55.12 180 top
R28  41.91,66.04 0 bottom
R29  52.32,57.91 90 bottom
R30  49.15,55.12 180 top
R31  23.62,63.12 0 bottom
R35  24.77,59.82 90 top
R36  24.77,54.86 180 top
R37  23.62,65.79 0 bottom
R38  34.04,57.66 90 bottom
R39  30.86,54.86 180 top
R46  61.98,63.12 0 bottom
R47  63.37,59.82 90 top
R48  63.12,54.86 180 top
R49  61.98,65.79 0 bottom
R50  72.39,57.66 90 bottom
R51  69.22,54.86 180 top
R54  12.57,22.35 180 bottom
R59  12.45,24.89 0 top
R60  12.45,27.43 180 bottom
R61  12.57,31.11 0 top
R62  79.88,62.61 0 bottom
R63  82.3,59.31 90 top
R64  81.03,54.36 180 top
R65  79.88,65.28 0 bottom
R66  12.57,39.24 180 bottom
R67  12.45,41.78 0 top
R68  12.45,44.32 180 bottom
R69  12.57,48.01 0 top
R70  90.3,57.15 90 bottom
R71  87.12,54.36 180 top
S2  16.8,13.53 270 top
SL1  16.8,5.89 180 top
TR6  3.68,60.33 270 bottom
TR7  7.75,61.47 0 bottom
TR8  42.29,60.07 270 bottom
TR9  46.35,61.21 0 bottom
TR11  24,59.82 270 bottom
TR12  28.07,60.96 0 bottom
TR15  62.36,59.82 270 bottom
TR16  66.42,60.96 0 bottom
TR19  80.26,59.31 270 bottom
TR20  84.33,60.45 0 bottom
TR21  19.05,29.34 90 top
TR22  19.05,24.89 90 top
TR25  19.05,46.23 90 top
TR26  19.05,41.78 90 top
U1  92.46,33.36 0 top
X1  25.15,15.62 0 top
X2  61.45,2.55 0 top
X3  51.4,2.55 0 top
X4  97.5,82.71 90 top
X5  97.41,43.43 90 top
X6  9.4,27.43 90 top
X7  37.71,2.55 0 top
X9  9.4,44.32 90 top

### Tracks (layer width: path | path; a pad name or v marks a point on that pad's centre or on a via)
3V3  (via drill 0.35)
  Top 0.305: C11.2 54.66,28.02 53.75,28.93 IC1.64 | C7.2 42.58,32.23 IC1.48 | C8.2 C9.2 C10.2 | U1.4 95.48,33.29 C24.2 | IC1.1 57.05,32.23 61.26,28.02 61.88,28.02 | C17.2 45.23,43.2 46.25,42.17 IC1.32 | C20.2 46.07,44.86 47.25,43.69 IC1.30 | IC1.13 65.63,38.23 C14.2 | v53.12,43.26 52.75,42.89 IC1.19
  Top 0.61: U1.4 U1.2 LED2.A | 53.72,5.33 51.4,3.01 X3.2 | 27.56,69.05 J1.22 J1.21 8.84,69.05 LED12.A LED11.A | 27.56,69.05 J3.21 J3.22 45.47,69.05 | 45.47,69.05 J4.21 J4.22 66.29,69.05 | 66.29,69.05 J5.21 J5.22 84.33,69.05 | 84.33,69.05 J6.21 J6.22 93.73,64.46 93.73,52.45 81.92,40.64 81.92,35.33 LED2.A | 33.66,5.33 v32.26,6.73 | 53.72,5.33 87.63,5.33 98.17,15.88 98.17,30.49 C24.2 | 53.72,5.33 33.66,5.33 | 33.66,5.33 23.71,5.33 SL1.1 | LED16.A LED17.A 24.5,65.98 27.56,69.05 | LED13.A LED14.A 42.78,66.37 45.47,69.05 | LED20.A LED21.A 63.03,65.79 66.29,69.05 | LED26.A LED27.A 80.76,65.48 84.33,69.05 | 79.71,33.36 78.66,33.36 73.53,38.48 v70.07,38.48 | 79.71,33.36 77.85,31.5 | 77.85,31.5 v75.12,28.76 | LED2.A 79.71,33.36 | 77.85,31.5 74.8,31.5 70.62,35.68 C5.2 | v34.16,31.62 34.32,31.78 C6.2 C7.2 | C11.2 C12.2 C13.2 61.88,28.02 v62.23,28.02 | C15.2 C16.2 C17.2
  Bottom 0.305: C21.2 36.67,44.86 35,43.2 | v53.12,43.26 56.98,43.26 C8.2
  Bottom 0.61: v32.26,6.73 32.26,29.72 | v34.16,31.62 32.26,29.72 | C5.2 C14.2 | 32.26,29.72 32.26,41.53 33.93,43.2 35,43.2 C15.2 | C21.2 C20.2 | v62.23,28.02 74.37,28.02 v75.12,28.76 | v70.07,38.48 66.03,42.52 C10.2
  other vias: 95.38,33.29 57.72,42.52 39.86,44.86 37.78,44.86 70.12,35.68 37.76,43.2 68.19,35.68 61.36,42.52
5V  (via drill 0.35)
  Top 0.61: 59.56,8.26 77.85,8.26 79.98,10.38 J2.5 J2.1 79.98,20.94 LED3.A 78.53,28.74 v78.62,28.83 | 7.62,23.15 7.62,21.34 16.51,12.45 20.83,12.45 25.02,8.26 59.56,8.26 | v58.17,6.86 59.56,8.26 | R59.1 11.53,24.93 X6.4 7.62,23.15 | R67.1 11.53,41.82 X9.4 7.62,40.05 | 7.62,23.15 7.62,30.35 | 7.62,30.35 7.62,40.05 | 7.62,40.05 7.62,47.24 8.49,48.12 11.59,48.12 R69.1 | 7.62,30.35 8.49,31.23 11.59,31.23 R61.1 | C22.2 U1.3 v85.78,31.05
  Bottom 0.61: IC3.3 84.13,27.73 | 84.13,27.73 83.67,29.68 82.3,31.05 | 84.13,27.73 IC3.5 | v58.17,6.86 58.17,6.82 X3.1 | 82.3,31.05 80.83,31.05 v78.62,28.83 | 82.3,31.05 v85.78,31.05
  other vias: 89.37,31.03
12V  (via drill 2.54)
  other vias: 3.73,87.56
  pour Top (no thermals): 0,83.44 100,83.44 100,100 0,100
  pour Bottom (no thermals): 0,100 100,100 100,83.44 0,83.44
CAN1_RX  (via drill 0.35)
  Top 0.305: v79.63,23.62 86.49,23.62 v87.63,24.77 | v39.88,33.66 40.45,34.23 IC1.44
  Top 0.61: v87.63,24.77 89.15,23.24 LED5.A
  Bottom 0.305: v79.63,23.62 77.6,23.62 74.4,20.42 57.78,20.42 56.47,21.73 46.85,21.73 39.88,28.71 v39.88,33.66
  Bottom 0.61: IC3.4 87.63,25.73 v87.63,24.77
CAN1_TX  (via drill 0.35)
  Top 0.305: IC1.45 40.97,33.73 v40.77,33.53
  Top 0.61: v82.17,26.8 LED4.A
  Bottom 0.305: v82.17,26.8 81.03,25.65 76.33,25.65 71.88,21.21 58.38,21.21 56.85,22.73 47.13,22.73 40.77,29.09 v40.77,33.53
  Bottom 0.61: IC3.1 81.51,27.45 v82.17,26.8
CANH
  Bottom 0.61: J2.6 J2.2 82.48,20.3 R9.2 82.78,20.6 IC3.7
CANL
  Bottom 0.61: J2.7 J2.3 84.48,20.33 R9.1 84.05,20.75 IC3.6
EN1A
  Top 0.305: X6.5 15.29,22.43 16.26,21.46 20.7,21.46 34.97,35.73 IC1.41
  Bottom 0.61: X6.5 9.48,22.35 R54.1
EN1B  (via drill 0.35)
  Top 0.305: X6.3 17.53,27.43 18.29,26.67 24.89,26.67 v33.27,35.05 | v35.31,35.05 35.49,35.23 IC1.42
  Bottom 0.305: v33.27,35.05 v35.3,35.05 v35.31,35.05
  Bottom 0.61: R60.1 X6.3
EN2A
  Top 0.305: X9.5 14.78,39.32 15.94,38.16 38.3,38.16 38.73,37.73 IC1.37
  Bottom 0.61: X9.5 9.48,39.24 R66.1
EN2B  (via drill 0.35)
  Top 0.305: X9.3 17.65,44.32 18.29,43.69 30.35,43.69 v35.12,38.92 | IC1.38 38.17,37.23 37.97,37.43 v36.45,37.43
  Bottom 0.305: v35.12,38.92 36.2,37.85 36.2,37.68 v36.45,37.43
  Bottom 0.61: R68.1 X9.3
GND  (via drill 0.35)
  other vias: 80.52,34.8 74.93,30.35 77.22,32.89 58.29,32.13 57.28,29.21 34.04,22.61 25.53,9.4 16.26,14.22 10.16,20.57 8.89,37.85 26.04,42.55 30.23,39.24 11.05,51.31 13.84,53.98 13.97,61.21 59.94,60.96 77.98,61.09 98.3,60.96 92.33,60.71 85.85,36.2 96.01,29.97 96.52,16.76 81.15,19.94 76.58,24.26 56.9,7.24 87.12,6.73 50.55,4.19 30.99,6.73 93.09,1.4 98.68,6.86 86.74,25.4 79.63,28.07 81.28,30.1 81.87,42.85 77.47,43.31 85.98,42.93 61.59,47.5 54.23,48.26 48.64,51.82 46.31,52.61 45.72,48.39 45.21,46.1 44.2,44.07 33.66,51.31 28.07,51.44 26.8,66.42 24.51,67.94 42.42,67.56 45.72,67.56 43.94,64.52 62.99,67.82 64.26,63.88 67.18,50.8 80.9,67.82 79.12,53.72 92.46,52.83 83.19,45.21 69.72,40.13 66.93,43.31 63.63,41.27 61.85,31.75 67.69,38.61 35.31,33.78 31.11,37.21 14.73,37.85 21.72,27.43 23.88,25.78 20.32,22.35 26.29,24.77 30.23,22.86 1.91,7.75 7.75,2.16 29.59,28.57 28.96,25.65 47.24,38.61 52.32,33.15 52.45,38.86 47.37,33.78 22.86,49.66 34.67,41.53 40.51,17.53 40.73,26.83 39.19,22.95 50.04,28.57 52.83,28.7 68.45,29.08 68.33,26.92 72.64,23.62 62.48,35.18 46.61,46.1 47.36,23.6 43.05,19.43 60.83,29.72 60.71,26.42 61.59,23.62 64.14,18.41 68.58,19.05 59.31,19.56 69.34,49.91 55.56,42.47 49.02,46.74 41.91,36.45 35.05,37.21 39.12,34.42 44.83,28.7 33.53,29.21 37.21,55.88 56.39,54.61 3.05,16.26 4.19,29.97 4.06,45.21
  pour Top (no thermals): 0,69.85 100,69.85 100,0 0,0
  pour Bottom (no thermals): 0,69.85 100,69.85 100,0 0,0
GND-M  (via drill 2.54)
  other vias: 3.73,77.91
  pour Top (no thermals): 0,82.42 100,82.42 100,70.74 0,70.74
  pour Bottom (no thermals): 0,82.42 100,82.42 100,70.74 0,70.74
I2C2_SCL  (via drill 0.35)
  Top 0.305: IC1.28 48.25,43.94 50.03,45.72 v50.04,45.72
  Bottom 0.305: v50.04,45.72 54.66,45.72 55.86,44.52 61.32,44.52 61.7,44.91 68.04,44.91 70.76,42.18 X5.2
I2C2_SDA  (via drill 0.35)
  Top 0.305: IC1.29 47.75,44.32 49.14,45.71 v49.14,45.73
  Bottom 0.305: X5.1 90.04,44.68 89.94,44.58 69.44,44.58 68.18,45.84 61.19,45.84 60.71,45.36 56,45.36 54.73,46.63 50.04,46.63 v49.14,45.73
MD1A  (via drill 0.35)
  Top 0.305: IC1.21 51.75,48.62 50.01,50.36 37.15,50.36 v36.96,50.55 | v5.95,53.06 5.32,53.69 R21.1 R20.1
  Bottom 0.305: v36.96,50.55 8.46,50.55 v5.95,53.06
MD1B  (via drill 0.35)
  Top 0.305: v49.02,27.3 49.25,27.53 IC1.55 | v43.2,27.62 43.01,27.81 32.77,27.81 v30.48,30.1 | v21.34,49.66 15.62,55.37 R24.1
  Bottom 0.305: v21.34,49.66 27.05,43.94 27.05,41.15 30.48,37.72 v30.48,30.1 | v49.02,27.3 43.51,27.3 v43.2,27.62
  Bottom 0.61: R23.1 11.8,55.37 R24.1
  other vias: 11.42,55.37
MD2A  (via drill 0.35)
  Top 0.305: IC1.16 61.88,39.73 62.62,40.47 62.62,43.12 61.65,44.08 59.52,44.08 v57.54,46.06 | R36.1 31.48,49.02 v49.07,49.02
  Top 0.61: R35.1 25.64,58.07 R36.1
  Bottom 0.305: v57.54,46.06 54.58,49.02 v49.07,49.02
MD2B  (via drill 0.35)
  Top 0.305: IC1.17 53.75,44.03 52.67,45.1 52.67,48.9 50.52,51.05 37.6,51.05 37.08,51.56 35.04,51.56 R39.1
  Bottom 0.61: R38.1 34.04,55.88 33.02,54.86 R39.1
  other vias: 31.74,54.86
MD3A  (via drill 0.35)
  Top 0.305: IC1.22 51.25,48.05 v49.65,49.66
  Top 0.61: R26.1 43.93,58.8 R27.1
  Bottom 0.305: R27.1 45.01,54.04 47.74,54.04 49.65,52.13 v49.65,49.66
  other vias: 43.93,55.12
MD3B  (via drill 0.35)
  Top 0.305: IC1.23 50.75,46.41 49.53,47.62 v49.45,47.7 | R30.1 50.02,54.11 v47.78,51.87
  Bottom 0.305: v47.78,51.87 47.78,49.37 v49.45,47.7
  Bottom 0.61: R29.1 52.32,55.88 51.56,55.12 R30.1
  other vias: 50.02,55.12
MD4A  (via drill 0.35)
  Top 0.305: v50.12,43.43 49.75,43.07 IC1.25 | R48.1 63.99,53.63 v54.39,44.03
  Top 0.61: R47.1 63.99,58.32 R48.1
  Bottom 0.305: v54.39,44.03 50.71,44.03 v50.12,43.43
  other vias: 63.99,54.86
MD4B  (via drill 0.35)
  Top 0.305: IC1.26 49.25,43.81 49.88,44.45 v50.04,44.45 | R51.1 70.09,52.59 68.71,51.21 68.71,48.97 v63.91,44.17
  Bottom 0.305: v50.04,44.45 50.32,44.73 54.81,44.73 55.72,43.82 63.56,43.82 v63.91,44.17
  Bottom 0.61: R51.1 70.77,54.86 72.39,56.48 R50.1
  other vias: 70.09,54.86
MD5A
  Top 0.305: R64.1 69.4,41.85 68.92,41.85 65.8,38.73 IC1.14
  Top 0.61: R63.1 81.9,58.04 R64.1
MD5B  (via drill 0.35)
  Top 0.305: IC1.15 65.01,39.23 70.14,44.36 70.14,45.43 v75.39,50.68 | v82.81,51.56 86.11,51.56 88,53.45 R71.1
  Bottom 0.305: v75.39,50.68 76.27,51.56 v82.81,51.56
  Bottom 0.61: R70.1 88.38,54.36 R71.1
  other vias: 88,54.36
N$1  (via drill 0.35)
  Top 0.305: LED7.K R8.1
  other vias: 67.4,18.29
N$2
  Bottom 0.61: TR6.3 2.58,61.34 3.51,62.27 4.73,62.27 R6.1
N$3  (via drill 0.35)
  Top 0.61: R20.2 3.57,60.06 v4.78,61.27
N$4  (via drill 0.35)
  other vias: 4.33,63.63
N$5
  Top 0.305: IC1.60 51.75,28.29 R1.2
N$6
  Bottom 0.61: R22.1 7.75,64.63 TR7.3
N$7
  Top 0.61: LED2.K 83.89,36.55 R3.1
N$8
  Top 0.61: R4.1 LED3.K
N$9
  Bottom 0.61: R23.2 12.39,60.37 TR7.1
N$10  (via drill 0.35)
  other vias: 4.33,66.29
N$11
  Top 0.61: LED5.K R5.1
N$12
  Top 0.305: R10.2
  Top 0.61: LED1.A R10.2
N$13
  Top 0.61: LED4.K R2.1
N$14  (via drill 0.35)
  Bottom 0.61: Q1.1 9.67,56.75 R24.2
  other vias: 9.67,55.37
N$15  (via drill 0.35)
  Top 0.152: R21.2
  Bottom 0.61: Q2.1 3.57,57.01 R21.2
  other vias: 3.57,55.37
N$16
  Bottom 0.61: TR8.3 41.19,61.09 42.78,62.68 R25.1
N$17  (via drill 0.35)
  Bottom 0.61: TR8.1 44.25,61.02 R26.2
  other vias: 44.32,60.95
N$18  (via drill 0.35)
  other vias: 41.03,63.37
N$19
  Bottom 0.61: R28.1 44.07,66.04 45.34,64.77 45.34,63.33 TR9.3
N$20  (via drill 0.35)
  Top 0.61: v18.56,22.35 TR22.1
  Bottom 0.61: R54.2 v18.56,22.35
N$21
  Top 0.61: TR22.3 LED24.K
N$22  (via drill 0.35)
  Top 0.305: LED6.K R7.1
  other vias: 67.41,22.48
N$23  (via drill 0.35)
  Bottom 0.305: R12.1 LED9.K
  other vias: 61.07,22.46
N$24
  Top 0.61: LED24.A R59.2
N$25  (via drill 0.35)
  Bottom 0.305: R11.1 LED8.K
  other vias: 61.07,18.16
N$29
  Bottom 0.61: R29.2 51,60.11 TR9.1
N$32  (via drill 0.35)
  other vias: 41.03,66.04
N$34  (via drill 0.35)
  Bottom 0.61: Q3.1 48.27,56.5 R30.2
  other vias: 48.27,55.12
N$35  (via drill 0.35)
  Bottom 0.61: Q4.1 42.18,56.75 R27.2
  other vias: 42.18,55.12
N$36
  Bottom 0.61: TR11.3 22.9,60.83 24.5,62.43 R31.1
N$37  (via drill 0.35)
  Top 0.61: R35.2 24.84,60.77 TR11.1
  other vias: 25.1,60.77
N$38  (via drill 0.35)
  Top 0.61: TR21.1 20.02,28.39 v19.07,27.43
  Bottom 0.61: R60.2 v19.07,27.43
N$46
  Top 0.61: TR21.3 17.95,29.79 LED25.K
N$47  (via drill 0.35)
  other vias: 22.75,63.12
N$48
  Top 0.61: LED25.A R61.2
N$49
  Bottom 0.61: R37.1 28.07,62.22 TR12.3
N$50
  Bottom 0.61: R38.2 32.71,59.86 TR12.1
N$51  (via drill 0.35)
  other vias: 22.75,65.79
N$52  (via drill 0.35)
  Bottom 0.61: Q5.1 29.99,56.24 R39.2
  other vias: 29.99,54.86
N$53  (via drill 0.35)
  Bottom 0.61: Q7.1 23.89,56.5 R36.2
  other vias: 23.89,54.86
N$62
  Bottom 0.61: TR15.3 61.26,60.83 62.85,62.43 R46.1
N$63  (via drill 0.35)
  Top 0.61: R47.2 63.45,60.77 TR15.1
  other vias: 63.46,60.77
N$64  (via drill 0.35)
  other vias: 61.1,63.12
N$65
  Bottom 0.61: R49.1 64.14,65.79 65.41,64.52 65.41,63.08 TR16.3
N$66
  Bottom 0.61: R50.2 71.06,59.86 TR16.1
N$67  (via drill 0.35)
  other vias: 61.1,65.79
N$68  (via drill 0.35)
  Bottom 0.61: Q10.1 68.34,56.24 R51.2
  other vias: 68.34,54.86
N$69  (via drill 0.35)
  Top 0.61: v18.56,39.24 TR26.1
  Bottom 0.61: R66.2 v18.56,39.24
N$70  (via drill 0.35)
  Bottom 0.61: Q11.1 62.24,56.5 R48.2
  other vias: 62.24,54.86
N$71
  Top 0.61: TR26.3 LED30.K
N$75
  Top 0.61: LED30.A R67.2
N$77  (via drill 0.35)
  Top 0.61: v19.07,44.32 20.02,45.28 TR25.1
  Bottom 0.61: R68.2 v19.07,44.32
N$81
  Top 0.61: TR25.3 17.95,46.68 LED31.K
N$83
  Top 0.61: LED31.A R69.2
N$88
  Bottom 0.61: TR19.3 79.16,60.33 80.76,61.92 R62.1
N$89  (via drill 0.35)
  Top 0.61: R63.2 81.44,60.18 TR19.1
  other vias: 81.36,60.26
N$90  (via drill 0.35)
  other vias: 79.01,62.61
N$91
  Bottom 0.61: R65.1 82.04,65.28 83.31,64.01 83.31,62.57 TR20.3
N$92
  Bottom 0.61: R70.2 88.97,59.35 TR20.1
N$93  (via drill 0.35)
  other vias: 79.01,65.28
N$94  (via drill 0.35)
  Bottom 0.61: Q15.1 86.25,55.73 R71.2
  other vias: 86.25,54.36
N$95  (via drill 0.35)
  Bottom 0.61: Q16.1 80.15,55.99 R64.2
  other vias: 80.15,54.36
NRST  (via drill 0.35)
  Top 0.305: C23.2 59.25,35.23 IC1.7 | v43.74,18.6 45.14,18.6 v50.04,23.5 | v33.4,18.67 v27.94,18.67
  Bottom 0.305: SL1.5 17.27,10.18 17.27,15.73 S2.A1 26.78,17.51 27.18,17.91 | C23.2 60.07,34.41 60.07,29.97 58.48,28.38 54.93,28.38 v50.04,23.5 | X1.1 27.17,16.39 27.17,17.91 27.18,17.91 | v43.74,18.6 33.47,18.6 v33.4,18.67 | v27.94,18.67 27.18,17.91
  other vias: 19.05,17.51 59.48,34.99
PA0  (via drill 0.35)
  Top 0.61: J6.26 J6.25 83.44,60.8 v83.44,57.15
  Bottom 0.61: v83.44,57.15 82.35,56.06 Q16.2
PA1  (via drill 0.35)
  Top 0.61: J6.23 J6.24 89.4,66.51 90.93,64.97 90.93,58.67 Q15.2
  other vias: 88.07,55.81
PA2  (via drill 0.35)
  Top 0.61: J3.26 J3.25 27.18,61.54 v27.18,57.66
  Bottom 0.61: Q7.2 26.09,56.57 v27.18,57.66
PA3  (via drill 0.35)
  Top 0.61: J3.23 J3.24 33.78,64.87 33.78,60.07 31.81,58.1 Q5.2
  other vias: 31.81,56.32
PA5  (via drill 0.35)
  Top 0.61: v6.86,58.17 6.86,61.09 9.74,63.97 J1.25 J1.26
  Bottom 0.61: v6.86,58.17 5.77,57.08 Q2.2
PA6  (via drill 0.35)
  Top 0.61: v45.47,57.91 45.47,61.21 48.22,63.97 J4.25 J4.26
  Bottom 0.61: v45.47,57.91 44.38,56.83 Q4.2
PA7  (via drill 0.35)
  Top 0.61: Q3.2 52.7,59.18 52.7,64.94 J4.24 J4.23
  other vias: 50.1,56.57
PB0  (via drill 0.35)
  Top 0.61: J5.26 J5.25 65.53,61.9 v65.53,57.66
  Bottom 0.61: v65.53,57.66 64.45,56.57 Q11.2
PB1  (via drill 0.35)
  Top 0.61: J5.23 J5.24 71.5,65.15 71.5,57.65 Q10.2
  other vias: 70.17,56.32
PB3  (via drill 0.35)
  Top 0.61: J1.23 J1.24 15.19,64.46 15.19,60.52 Q1.2
  other vias: 11.49,56.83
PB12  (via drill 0.35)
  Top 0.305: IC1.33 41.62,39.73 v40.27,38.38
  Bottom 0.305: JP1.5 52.23,12.48 47.98,12.48 44.49,15.96 44.49,19.14 36.44,27.2 36.44,34.55 v40.27,38.38
PB13  (via drill 0.35)
  Top 0.305: v41.23,38.43 42.03,39.23 IC1.34
  Bottom 0.305: JP1.3 50.4,13.19 48.91,13.19 45.76,16.34 45.76,19.3 37.44,27.62 37.44,34.64 v41.23,38.43
PB14  (via drill 0.35)
  Top 0.305: v42.24,38.43 42.53,38.73 IC1.35
  Bottom 0.305: JP1.1 47.18,16.7 47.18,19.38 38.35,28.21 38.35,34.55 v42.24,38.43
PC1
  Top 0.305: IC1.9 63.93,36.23 69.47,30.7 69.47,18.55 67.3,16.38 55.12,16.38 JP1.6
PC2  (via drill 0.35)
  Top 0.305: IC1.10 64.62,36.73 70.61,30.73 70.61,18.35 68.01,15.74 v56.36,15.74
  Bottom 0.305: v56.36,15.74 53.22,15.74 JP1.4
PC3
  Top 0.305: IC1.11 65.51,37.23 71.5,31.24 71.5,17.85 68.77,15.11 55.9,15.11 55.27,15.75 50.67,15.75 JP1.2
PC14
  Top 0.305: IC1.3 56.8,33.23 57.11,32.92 58.63,32.92 62.93,28.62 62.93,26.06 LED9.A
PC15
  Top 0.305: IC1.4 56.95,33.73 57.3,33.38 59.31,33.38 63.7,28.98 63.7,22.54 LED8.A
PH0
  Top 0.305: IC1.5 57.33,34.23 57.72,33.83 61.09,33.83 64.52,30.4 64.52,19.35 LED7.A
PH1
  Top 0.305: IC1.6 57.47,34.73 57.91,34.29 61.9,34.29 65.69,30.5 LED6.A
SPI3_MISO  (via drill 0.35)
  Top 0.305: v38.96,9.14 38.96,17.73 47.75,26.52 IC1.52
  Bottom 0.305: X7.2 v38.96,9.14
SPI3_MOSI  (via drill 0.35)
  Top 0.305: IC1.53 48.25,25.77 41.43,18.95 v41.43,9.04
  Bottom 0.305: v41.43,9.04 41.43,2.58 X7.1
SPI3_NSS  (via drill 0.35)
  Top 0.305: v33.96,9.14 33.96,15.53 46.75,28.32 IC1.50
  Bottom 0.305: X7.4 v33.96,9.14
SPI3_SCK  (via drill 0.35)
  Top 0.305: IC1.51 47.25,27.12 36.46,16.33 v36.46,9.14
  Bottom 0.305: X7.3 v36.46,9.14
SWCLK  (via drill 0.35)
  Top 0.305: IC1.49 46.25,29.03 29.92,12.7 v29.19,12.7
  Bottom 0.305: SL1.2 27.41,12.7 v29.19,12.7
SWDIO  (via drill 0.35)
  Top 0.305: IC1.46 41.48,33.23 41.15,32.89 34.04,32.89 31.5,30.35 v31.47,30.35
  Bottom 0.305: SL1.4 23.73,14.1 27.81,14.1 31.47,17.76 v31.47,30.35
USART1_RX  (via drill 0.35)
  Top 0.305: IC1.59 51.25,25.08 52.2,24.13 52.8,24.13 v57.14,19.79 | v60.46,13.51 60.71,13.26 v60.71,9.14
  Bottom 0.305: v60.71,9.14 60.71,3.06 X2.2 | v57.14,19.79 58.5,18.43 58.5,15.47 v60.46,13.51
USART1_TX  (via drill 0.35)
  Top 0.305: IC1.58 50.75,24.22 57.54,17.43 v57.55,17.43
  Bottom 0.305: X2.1 62.7,9.21 57.55,14.36 v57.55,17.43

### Text on the board
bPlace: Miracle Fry !! | C:/Users/kokkoro/Pictures/画像2.bmp
tNames: 12V | MD_1B | MD_2B | MD_3B | MD_4B | MD_5B | MD_1A | MD_2A | MD_3A | MD_4A | MD_5A | Unitbase_Keinz_2022 | EN-2B | I2C2_SDA | I2C_SCL | EN-2A | STM32F732RET6 | 3V3 | EN-1B | CAN_TX | EN-1A | CAN_RX | PC14 | PH1 | 5V | PC3 | PC2 | PC1 | PC15 | PH0 | RESET | RESET | PB14 | PB13 | PB12 | SPI3_NSS | SPI3_SCK | SPI3_MISO | SPI3_MOSI | USART1_RX | USART1_TX | Power_supply | GND | 3v3 | 5v